# EAGLE design zdrojV3 (EAGLE 6.1)
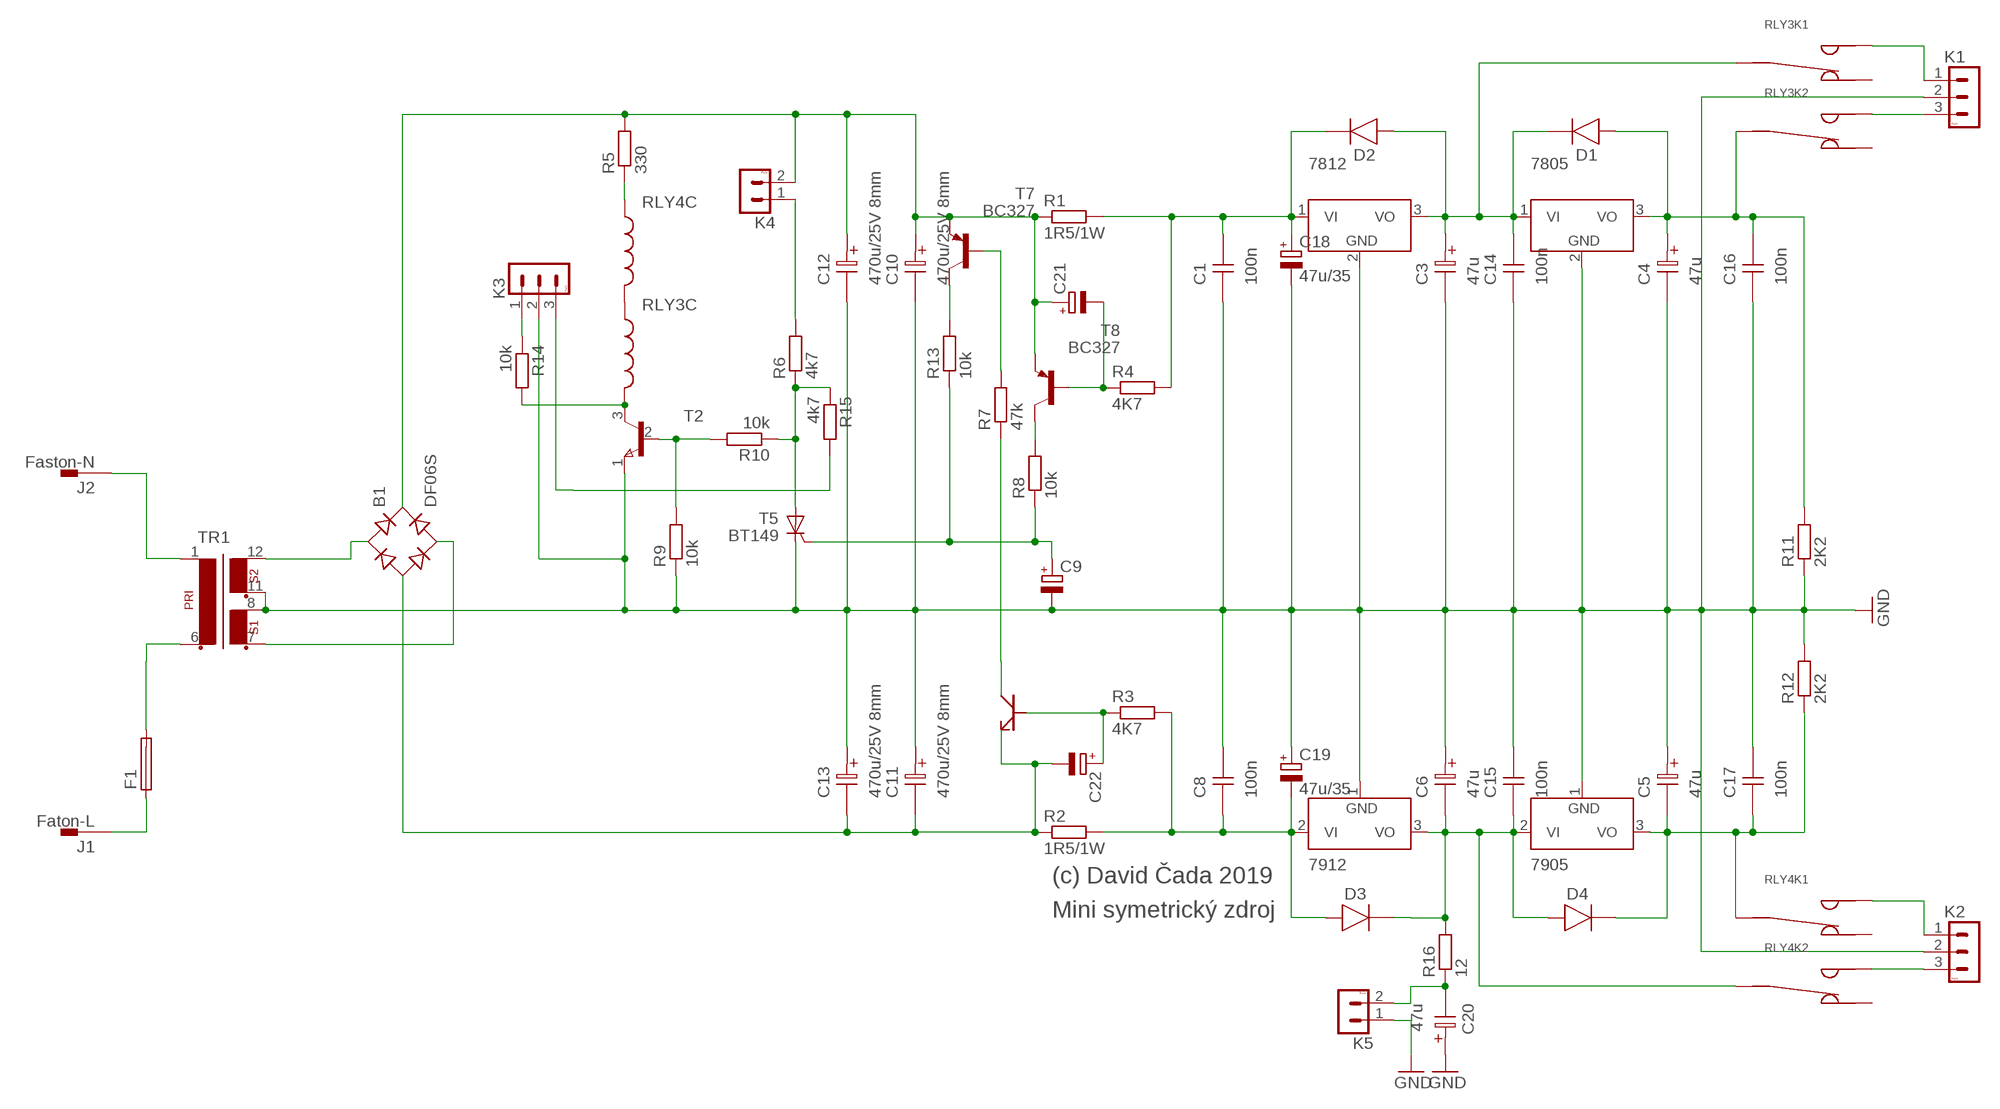
[diagram p0: schematic, sheet 1]

## Parts
7805  7812  [TO-220S]
7812  7805  [TO-220S]
7905  7912  [TO-220S]
7912  7905  [TO-220S]
B1  DF06S  [DFS]
C1  100n  CKS  [CK]
C3  47u  CT12  [CT12]
C4  47u  CT12  [CT12]
C5  47u  CT12  [CT12]
C6  47u  CT12  [CT12]
C8  100n  CKS  [CK]
C9  CPOL-EUE2.5-6  [E2,5-6]
C10  470u/25V 8mm  CT12  [CT12]
C11  470u/25V 8mm  CT12  [CT12]
C12  470u/25V 8mm  CT12  [CT12]
C13  470u/25V 8mm  CT12  [CT12]
C14  100n  CKS  [CK]
C15  100n  CKS  [CK]
C16  100n  CKS  [CK]
C17  100n  CKS  [CK]
C18  47u/35  CPOL-EUE2.5-6  [E2,5-6]
C19  47u/35  CPOL-EUE2.5-6  [E2,5-6]
C20  47u  CT12  [CT12]
C21  CPOL-EUE2.5-6  [E2,5-6]
C22  CPOL-EUE2.5-6  [E2,5-6]
D1  1N4007  [DO41]
D2  1N4007  [DO41]
D3  1N4007  [DO41]
D4  1N4007  [DO41]
F1  19560  [19560]
J1  Faton-L  PIN2F061.100  [F061.100]
J2  Faston-N  PIN2F061.100  [F061.100]
K1  PSH02-03P  [PSH02-03P]
K2  PSH02-03P  [PSH02-03P]
K3  PSH02-03P  [PSH02-03P]
K4  PSH02-02P  [PSH02-02P]
K5  PSH02-02P  [PSH02-02P]
R1  1R5/1W  R-EU_0411/3V  [0411V]
R2  1R5/1W  R-EU_0411/3V  [0411V]
R3  4K7  R-EU_0207/2V  [0207/2V]
R4  4K7  R-EU_0207/2V  [0207/2V]
R5  330  R-EU_0207/2V  [0207/2V]
R6  4k7  R-EU_0207/2V  [0207/2V]
R7  47k  R-EU_0207/2V  [0207/2V]
R8  10k  R-EU_0207/2V  [0207/2V]
R9  10k  R-EU_0207/2V  [0207/2V]
R10  10k  R-EU_0207/2V  [0207/2V]
R11  2K2  R-EU_0207/2V  [0207/2V]
R12  2K2  R-EU_0207/2V  [0207/2V]
R13  10k  R-EU_0207/2V  [0207/2V]
R14  10k  R-EU_0207/2V  [0207/2V]
R15  4k7  R-EU_0207/2V  [0207/2V]
R16  12  R-EU_0207/2V  [0207/2V]
RLY3  RELEG5V2  [RG5V2]
RLY4  RELEG5V2  [RG5V2]
T2  BC337-40  [TO-92C]
T5  BT149  [TO92-4]
T6  MPSA44  [TO92-EBC]
T7  BC327  [TO92]
T8  BC327  [TO92]
TR1  EI48-2  [EI48-2]

## Nets
GND: 7805.2(GND) 7812.2(GND) 7905.1(GND) 7912.1(GND) C1.1 C3.2 C4.2 C5.1 C6.1 C8.2 C9.- C10.2 C11.1 C12.2 C13.1 C14.1 C15.2 C16.1 C17.2 C18.- C19.+ C20.1 K1.2 K2.2 K3.2 K5.1 R9.1 R11.1 R12.2 T2.1(E) T5.C TR1.8 TR1.11
LEDGREEN+: K3.3 R15.2
N$1: R7.2 T7.2(B)
N$2: 7805.1(VI) 7812.3(VO) C3.1 C14.2 D1.K D2.A RLY3.3
N$3: 7905.2(VI) 7912.3(VO) C6.2 C15.1 D3.K D4.A R16.2 RLY4.6
N$4: 7912.2(VI) C8.1 C19.- D3.A R2.2 R3.2
N$5: 7812.1(VI) C1.2 C18.+ D2.K R1.2 R4.2
N$6: K1.1 RLY3.5
N$7: 7905.3(VO) C5.2 C17.1 D4.K R12.1 RLY4.3
N$8: R13.2 T7.3(C)
N$9: R9.2 R10.2 T2.2(B)
N$10: C22.+ R3.1 T6.B
N$11: C21.- R4.1 T8.2(B)
N$12: RLY3.1 RLY4.2
N$13: R5.1 RLY4.1
N$14: C9.+ R8.1 R13.1 T5.G
N$15: R6.1 R10.1 R15.1 T5.A
N$16: R14.2 RLY3.2 T2.3(C)
N$17: K4.1 R6.2
N$18: K3.1 R14.1
N$19: R7.1 T6.E(C)
N$20: R8.2 T8.3(C)
N$21: F1.2 TR1.6
N$22: B1.+ C10.1 C12.1 C21.+ K4.2 R1.1 R5.2 T7.1(E) T8.1(E)
N$23: B1.AC1 TR1.12
N$24: B1.AC2 TR1.7
N$25: 7805.3(VO) C4.1 C16.2 D1.A R11.2 RLY3.6
N$26: B1.- C11.2 C13.2 C22.- R2.1 T6.C(E)
N$28: K1.3 RLY3.8
N$29: K2.1 RLY4.5
N$30: K2.3 RLY4.8
N$31: C20.2 K5.2 R16.1
N$34: J2.A1 J2.A2 TR1.1
POJISTKA: F1.1 J1.A1 J1.A2
Unconnected: RLY3.4 RLY3.7 RLY4.4 RLY4.7

## Notes on the sheet
- (c) David Čada 2019
- Mini symetrický zdroj

## Library data of the parts
7805 = #_GM99:7812
7812 = #_GM99:7805
7905 = #_GM99:7912
7912 = #_GM99:7905
B1 = rectifier:DF*S: Surface Mount Glass Passivated Bridge Rectifiers Source: Source: Comchip Bridge Rectifiers DF005S-G thru DF10S-G.pdf
C1 C8 C14-C17 = #_GM99:CKS
C3-C6 C10-C13 C20 = #_GM99:CT12
C9 C18 C19 C21 C22 = rcl:CPOL-EU: POLARIZED CAPACITOR, European symbol
D1-D4 = #_GM99:1N4007
F1 = fuse:19560: FUSE HOLDER TR5, Wickmann; MPN: 56000001009; OC_FARNELL: 1185363; OC_NEWARK: 15P8392
J1 J2 = con-faston:PIN2: Flachstecker Typ Tyco/Electronics/AMP TAB, FASTON Printed Circuit Board Tabs Source: http://www.buerklin.com, http://catalog.tycoelectronics.com; OC_FARNELL: unknown; OC_NEWARK: unknown
K1-K3 = #PaJa_konektory:PSH02-03: Konektory se zamkem - vidlice - 3pin
K4 K5 = #PaJa_konektory:PSH02-02: Konektory se zamkem - vidlice - 2pin
R1-R16 = rcl:R-EU_: RESISTOR, European symbol
RLY3 RLY4 = #_GM99:RELEG5V2
T2 = #_GM99:BC337-40
T5 = triac:BT149: THYRISTOR
T6 = MPSA44_NEW2:MPSA44
T7 T8 = transistor-pnp:BC327: PNP Transistor
TR1 = trafo:EI48-2: TRANSFORMER 1 primary winding, 2 secondary windings ERA

## Board
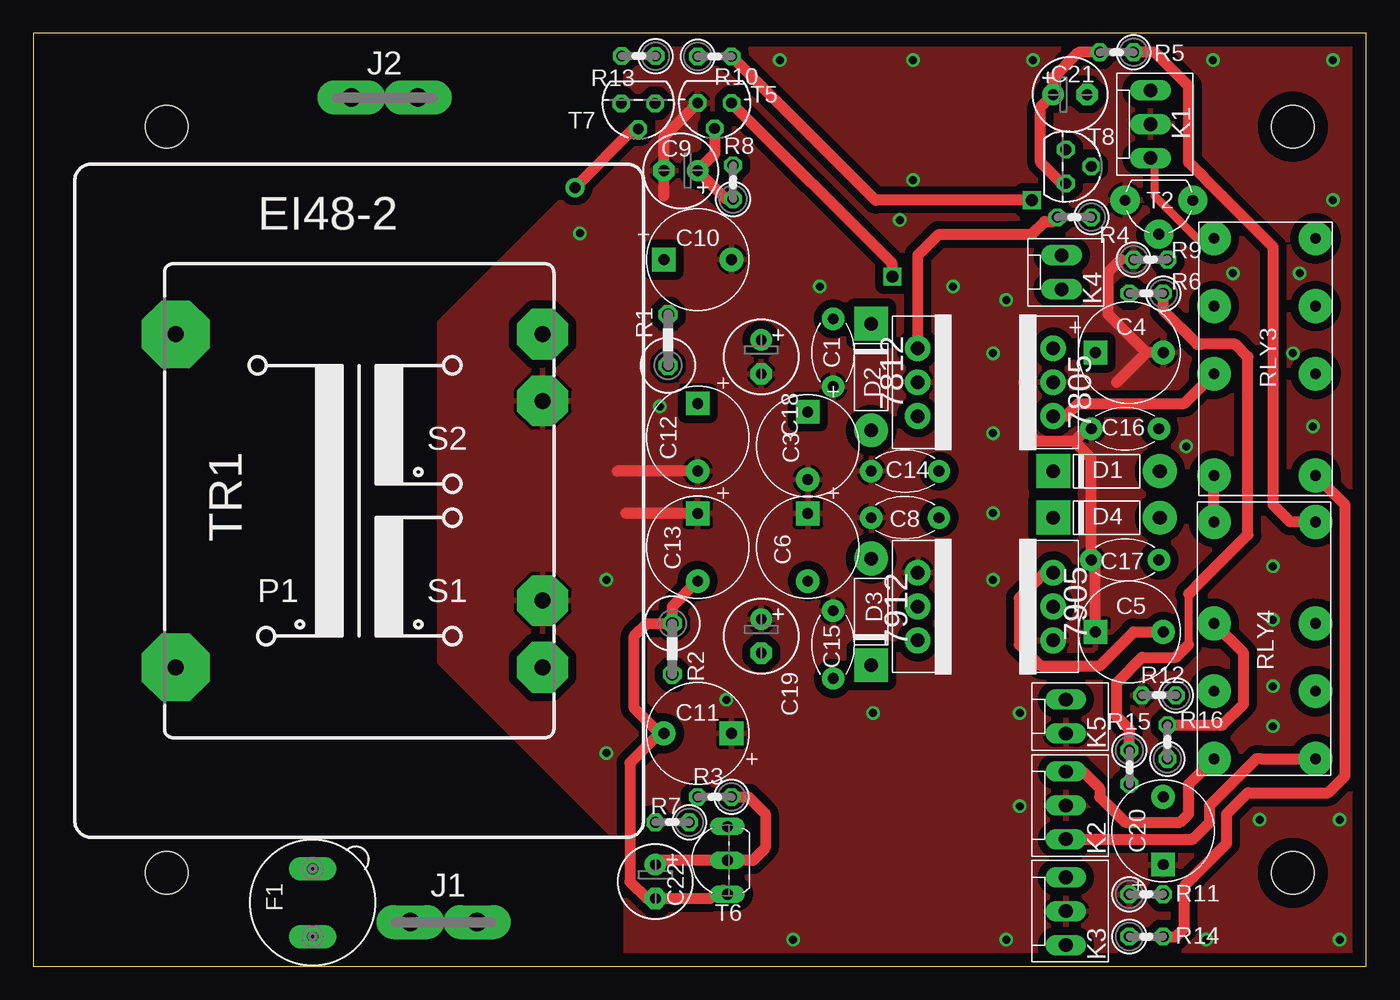
[diagram p1: board, top side]
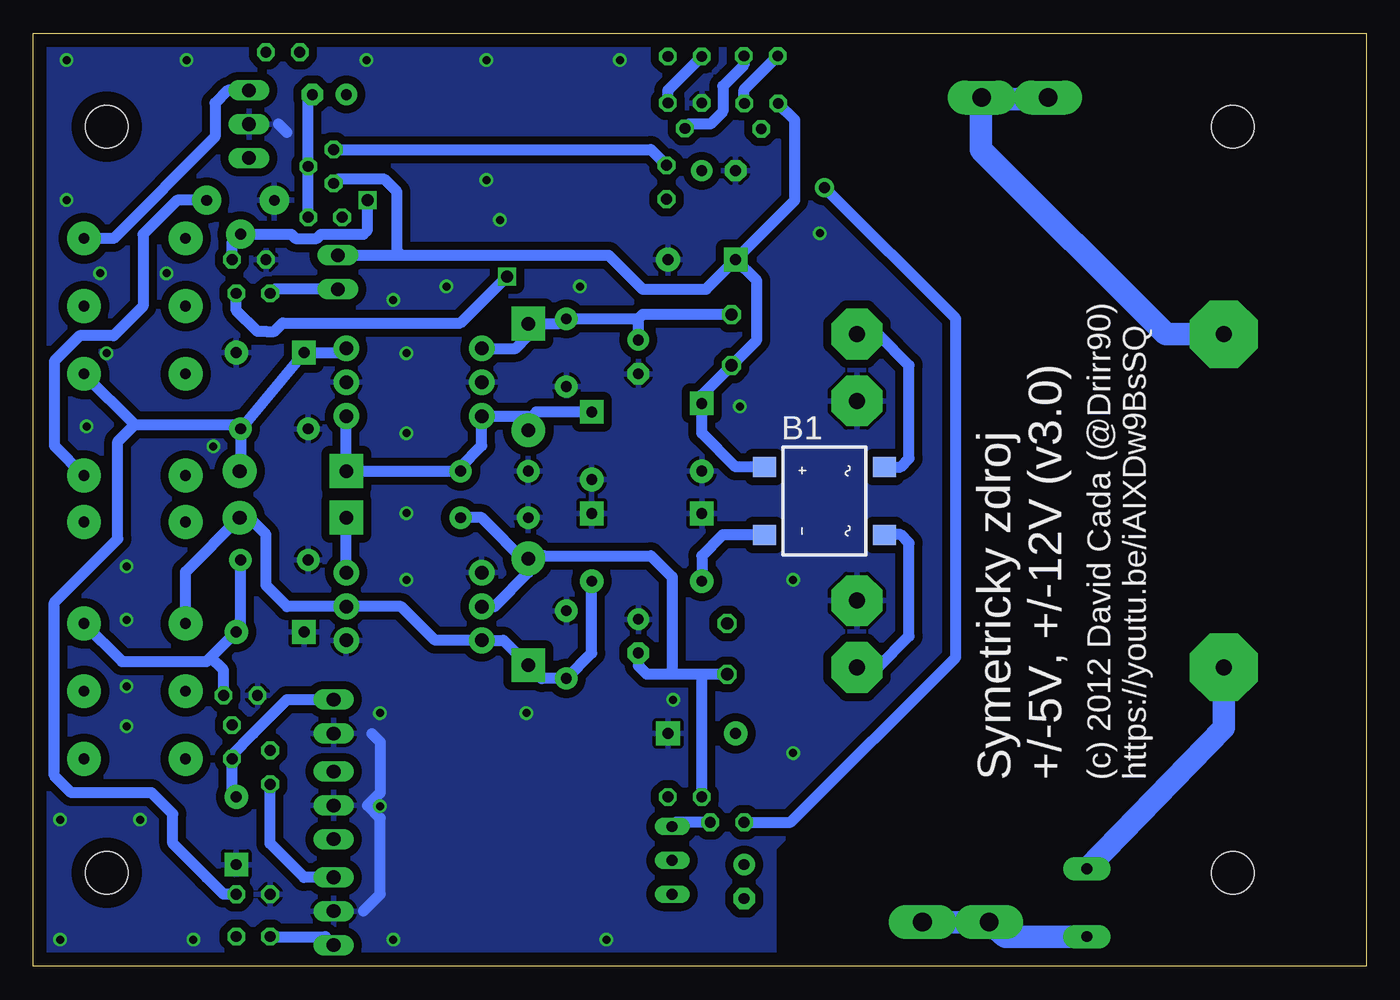
[diagram p2: board, bottom side, seen from below]

Size 100 x 70 mm. Coordinates in mm from the lower left corner, seen from the top.
Outline: 0,0 100,0 100,70 0,70 0,0
Copper layers (1*16): Top 0.035mm / dielectric 1.5mm / Bottom 0.035mm
Design rules "default": minimum track width 10mil, minimum drill 24mil, track to track 8mil, track to pad 8mil, pad to pad 8mil, via to via 8mil, smd to smd 8mil, copper to edge 40mil, drill to drill 8mil, minimum pad ring 10mil, minimum via ring 8mil, stop-mask expansion 4mil, vias tented up to drill 0mil, thermal gap 10mil
Holes 3.2 mm at 10,63 10,7 94.5,63 94.5,7

### Footprints (pad centres in the part's own frame; a part is rotated, then mirrored left to right if it is on the bottom)
TO-220S = drill 1.016 pad 1.93: 1 0,0; 2 2.54,0; 3 5.08,0
DFS = smd 1.5 x 1.7: + -2.55,-4.5; - 2.55,-4.5; AC1 -2.55,4.5; AC2 2.55,4.5
CK = drill 0.813 pad 1.676: 1 0,0; 2 5.08,0
CT12 = drill 0.813 pad 1.778 square: 1 0,0 | drill 0.813 pad 1.778: 2 5.08,0
E2,5-6 = drill 0.813 pad 1.6: + -1.27,0 | drill 0.813 pad 1.6 octagon: - 1.27,0
DO41 = drill 1.016 pad 2.54: A 8,0 | drill 1.016 pad 2.54 square: K 0,0
19560 = drill 0.813 pad 1.778 long: 1 -2.54,0; 2 2.54,0
F061.100 = drill 1.4 pad 2.54 long: A1 -2.5,0; A2 2.5,0
PSH02-03P = drill 1.016 pad 1.422 long: 1 -2.54,0; 2 0,0; 3 2.54,0
PSH02-02P = drill 1.016 pad 1.422 long: 1 -1.27,0; 2 1.27,0
0411V = drill 0.914 octagon: 1 -2.54,0; 2 1.27,0
0207/2V = drill 0.813 octagon: 1 -1.27,0; 2 1.27,0
RG5V2 = drill 0.813 pad 2.54: 1 0,7.62; 2 0,0; 3 7.62,7.62; 4 12.7,7.62; 5 17.78,7.62; 6 7.62,0; 7 12.7,0; 8 17.78,0
TO-92C = drill 0.813 pad 2.184: 1 0,-1.27; 2 2.54,1.27; 3 0,3.81
TO92-4 = drill 0.813 octagon: A -1.27,0; C 1.27,0; G 0,1.905
TO92-EBC = drill 0.813 long: B 0,-1.27; C -2.54,-1.27; E 2.54,-1.27
TO92 = drill 0.813 octagon: 1 1.27,0; 2 0,1.905; 3 -1.27,0
EI48-2 = drill 1.194 pad 5.08 octagon: 1 -13.767,12.497; 6 -13.767,-12.497 | drill 1.194 pad 3.81 octagon: 7 13.767,-12.497; 8 13.767,-7.493; 11 13.767,7.493; 12 13.767,12.497

### Placement (x,y rotation side)
7805  76.52,41.27 90 top
7812  66.36,46.35 270 top
7905  76.52,24.45 90 top
7912  66.36,29.53 270 top
B1  40.64,34.92 270 bottom
C1  60.01,43.5 90 top
C3  58.1,41.59 270 top
C4  79.69,46.04 0 top
C5  79.69,25.08 0 top
C6  58.1,33.97 270 top
C8  67.94,33.66 180 top
C9  48.58,59.69 180 top
C10  47.31,53.02 0 top
C11  52.39,17.46 180 top
C12  49.85,42.23 270 top
C13  49.85,33.97 270 top
C14  62.87,37.15 0 top
C15  60.01,21.59 90 top
C16  79.38,40.32 0 top
C17  84.45,30.48 180 top
C18  54.61,45.72 270 top
C19  54.61,24.77 270 top
C20  84.77,7.62 90 top
C21  77.79,65.41 0 top
C22  46.67,6.35 270 top
D1  76.52,37.15 0 top
D2  62.87,48.21 270 top
D3  62.87,22.59 90 top
D4  76.52,33.66 0 top
F1  20.95,4.76 90 top
J1  30.8,3.3 0 top
J2  26.35,65.18 180 top
K1  83.82,63.18 90 top
K2  77.47,12.06 90 top
K3  77.47,4.13 90 top
K4  77.15,52.07 90 top
K5  77.47,18.73 90 top
R1  47.62,47.62 90 top
R2  47.94,23.18 270 top
R3  51.12,12.7 180 top
R4  78.11,56.2 180 top
R5  81.28,68.58 180 top
R6  83.5,50.48 180 top
R7  47.94,10.79 180 top
R8  52.5,58.83 90 top
R9  83.82,53.02 0 top
R10  51.12,68.26 0 top
R11  83.5,5.4 0 top
R12  84.45,20.32 180 top
R13  45.42,68.3 180 top
R14  83.5,2.22 0 top
R15  82.23,14.92 270 top
R16  85.09,16.83 90 top
RLY3  96.2,36.83 90 top
RLY4  88.58,33.34 270 top
T2  83.19,57.47 270 top
T5  51.12,64.77 180 top
T6  50.8,7.94 90 top
T7  45.38,64.73 180 top
T8  77.47,60.01 270 top
TR1  24.45,34.92 0 top

### Tracks (layer width: path | path; a pad name or v marks a point on that pad's centre or on a via)
GND  (via drill 0.6)
  Top 0.813: C12.2 43.8,37.15 | C13.1 44.44,33.97 | 47.31,57.78 C9.- 47.31,62.23 T5.C | C16.1 79.06,40.32 78.11,39.37 | 78.11,39.37 75.25,39.37 74.61,40.01 74.61,43.5 74.3,43.81 | C4.2 83.5,46.04 | 83.5,46.04 81.28,43.81 | 83.5,46.04 80.64,48.9 80.64,52.07 81.6,53.02 | C5.1 79.69,30.16 C17.2 79.38,38.1 78.11,39.37
  Bottom 0.406: C20.1 84.45,7.62
  Bottom 0.813: 80.96,62.55 81.6,63.18 | 75.25,4.13 73.98,5.4 73.98,11.11 74.93,12.06 73.98,13.02 73.98,16.83 74.61,17.46
  other vias: 65,56 66,59 56,68 66,68 75,68 69,51 59,51 73,50 57,2 73,2 98,2 88,2 92,11 98,11 93,18 93,21 93,30 93,26 86.5,39 90,52 74,12 74,19 63,19 52,20 72,29 72,34 72,40 72,46 41,55 47,42 43,16 43,29 94.5,46 96,40.5 95,52 88.5,68 97.5,68 97.5,57.5
  pour Top (isolate 0.61): 30.48,22.86 43.18,10.16 44.45,8.89 44.45,0 100.33,0 100.33,69.85 44.45,69.85 44.45,62.23 30.48,48.26
  pour Bottom (isolate 0.61): 30.48,22.86 44.45,8.89 44.45,0 100.33,0 100.33,69.85 44.45,69.85 44.45,62.23 30.48,48.26
LEDGREEN+
  Bottom 0.813: K3.3 79.69,6.67 82.23,9.21 R15.2
N$1  (via drill 0.8 pad 1.42)
  Top 0.406: 45.09,62.87 45.38,62.87 T7.2
  Top 0.813: v40.64,58.42 45.09,62.87
  Bottom 0.813: R7.2 43.18,10.79 30.8,23.18 30.8,48.58 v40.64,58.42
N$2
  Top 0.813: 7805.1 77.47,41.27 78.42,42.23 86.36,42.23 RLY3.3
  Bottom 0.813: 62.91,40.95 62.93,41.27 7812.3 66.36,39.05 67.94,37.47 C14.2 D1.K 7805.1 | 62.91,40.95 D2.A | C3.1 62.26,41.59 62.91,40.95
N$3
  Top 0.813: R16.2 89.22,18.1 90.81,19.68 90.81,23.5 RLY4.6
  Bottom 0.813: C6.2 58.1,23.5 C15.1 61.87,21.59 D3.K 64.72,24.45 7912.3 69.85,24.45 72.39,26.99 7905.2 80.96,26.99 82.55,28.57 82.55,32.38 83.82,33.66 D4.A 88.58,29.59 RLY4.6
N$4
  Bottom 0.813: R2.2 50.16,21.91 | 50.16,21.91 52.07,21.91 | 52.07,21.91 53.98,21.91 54.61,22.54 C19.- | R3.2 49.85,21.59 50.16,21.91 | D3.A 61.66,30.8 53.66,30.8 52.07,29.21 52.07,21.91 | D3.A 62.87,29.53 65.41,26.99 7912.2 | D3.A 62.87,30.16 66.36,33.66 C8.1
N$5
  Top 0.813: 7812.1 66.36,53.34 67.94,54.93 74.93,54.93 75.88,55.88 76.52,55.88 R4.2
  Bottom 0.813: R1.2 54.29,48.9 54.61,48.58 | 7812.1 63.82,46.35 62.87,47.31 D2.K 60.64,48.21 C1.2 54.61,48.58 | C18.+ 54.61,48.58
N$6
  Top 0.61: RLY3.5 87.31,54.61 84.14,57.78 84.14,60.33 K1.1
N$7
  Top 0.813: 7905.3 75.88,29.53 73.98,27.62 73.98,24.13 75.56,22.54 80.01,22.54 82.55,25.08 C5.2
  Bottom 0.813: 7905.3 D4.K | D4.K 76.2,33.34 76.2,33.66 D4.K | D4.K 76.83,33.34 76.83,33.66 | RLY4.3 93.34,22.86 87,22.86 86.68,23.18 | C17.1 84.45,25.4 C5.2 86.68,23.18 | R12.1 85.72,22.23 86.68,23.18
N$8
  Bottom 0.813: T7.3 46.66,64.75 46.67,64.77 46.67,65.78 R13.2
N$9  (via drill 0.9)
  Top 0.813: v74.93,57.47 63.18,57.47 R10.2
  Bottom 0.813: R9.2 85.09,54.29 T2.2 80.64,54.93 80.33,54.61 78.74,54.61 78.42,54.93 75.25,54.93 74.93,55.24 v74.93,57.47
N$10
  Top 0.813: R3.1 53.66,12.7 54.93,11.43 54.93,8.89 53.98,7.94 T6.B 46.99,7.94 C22.+
N$11
  Bottom 0.813: R4.1 T8.2 79.38,65.09 C21.-
N$12
  Top 0.813: RLY4.2 RLY3.1
N$13
  Top 0.813: RLY4.1 94.3,33.34 93.03,34.61 93.03,53.98 89.22,57.78 86.68,60.33 86.68,66.04 84.14,68.58 R5.1
N$14
  Top 0.813: T5.G 51.12,60.96 C9.+ 51.98,57.56 R8.1
  Bottom 0.813: R13.1 46.69,67.61 48.26,66.04 48.26,64.14 49.21,63.18 50.8,63.18 T5.G
N$15  (via drill 0.9)
  Top 0.61: 86.68,24.13 86.68,27.94
  Top 0.813: R15.1 82.23,17.78 81.28,18.73 81.28,21.27 83.19,23.18 85.72,23.18 86.68,24.13 | 86.68,27.94 87.63,28.89 91.12,32.38 91.12,45.72 90.17,46.67 87.63,46.67 87.31,46.67 84.77,49.21 R6.1 | v64.45,51.75 64.45,52.7 T5.A
  Bottom 0.813: T5.A 52.39,65.72 R10.1 | v64.45,51.75 67.94,48.26 81.28,48.26 81.92,47.62 82.55,47.62 83.19,47.62 84.77,49.21 R6.1
N$16
  Top 0.813: R14.2 85.72,2.22 86.36,2.86 86.36,6.03 87,6.67 89.53,9.21 89.53,11.43 91.12,13.02 97.16,13.02 98.42,14.29 98.42,34.61 RLY3.2
  Bottom 0.813: T2.3 89.22,57.47 91.76,54.93 91.76,49.53 93.98,47.31 96.52,47.31 98.42,45.4 98.42,39.05 RLY3.2
N$17
  Bottom 0.813: K4.1 81.92,50.8 R6.2
N$18
  Bottom 0.813: R14.1 78.11,2.22 K3.1
N$19
  Bottom 0.813: R7.1 51.75,10.79 T6.E
N$20
  Top 0.813: R8.2 52.48,60.1 52.39,60.01
  Bottom 0.813: T8.3 53.67,61.28 R8.2
N$21
  Bottom 1.676: TR1.6 10.68,17.89 F1.2
N$22
  Top 0.813: T8.1 77.15,58.74 75.56,60.33 75.56,64.45 C21.+ 76.52,66.67 78.42,68.58 R5.2
  Bottom 0.813: 72.39,53.34 K4.2 73.03,53.34 72.71,53.66 | 72.39,53.34 56.83,53.34 54.29,50.8 49.53,50.8 C10.1 | C10.1 42.86,57.47 42.86,63.48 T7.1 | 72.71,53.66 72.39,53.34 | 72.71,53.66 72.71,58.1 73.66,59.05 77.15,59.05 T8.1 | C10.1 45.72,51.44 45.72,46.99 R1.1 49.85,42.86 C12.1 49.85,40.32 49.85,40.01 47.32,37.48 B1.+
N$23
  Bottom 0.813: TR1.12 36.63,47.42 34.29,45.09 34.29,38.1 34.91,37.48 B1.AC1
N$24
  Bottom 0.813: TR1.7 36.63,22.43 34.29,24.77 34.29,31.75 34.92,32.38 B1.AC2
N$25
  Bottom 0.813: C16.2 C4.1 76.83,46.04 7805.3 | RLY3.6 92.39,40.64 | 92.39,40.64 88.01,40.64 84.77,40.64 C16.2 | C16.2 84.45,37.21 D1.A | R11.2 85.72,5.4 87,6.67 88.9,8.57 89.53,9.21 89.53,11.43 91.12,13.02 97.16,13.02 98.42,14.29 98.42,27.3 93.66,32.07 93.66,39.37 92.39,40.64
N$26
  Top 0.813: 46.99,17.46 44.77,15.24 44.77,6.35 46.04,5.08 C22.- | 51.75,5.71 T6.C 51.12,5.4 50.8,5.08 C22.- | C11.2 46.99,17.46 | 46.99,17.46 45.09,19.37 45.09,24.77 46.04,25.72 R2.1 47.94,26.99 C13.2 | C22.- 46.35,5.08
  Bottom 0.813: C13.2 49.85,30.8 48.26,32.38 B1.-
N$28
  Bottom 0.813: K1.3 85.41,65.72 86.36,64.77 86.36,62.23 93.98,54.61 RLY3.8
N$29
  Top 0.813: RLY4.5 92.08,15.56 91.76,15.56 89.22,13.02 88.27,12.06 88.27,10.79 87,9.53 80.33,9.53 80.01,9.53 79.69,9.53 78.74,9.53 K2.1
N$30
  Top 0.813: K2.3 78.74,14.61 80.01,13.34 80.01,12.7 81.92,10.79 86.04,10.79 86.68,11.43 86.68,13.65 RLY4.8
N$31
  Bottom 0.813: 77.79,19.68 K5.2 80.33,20 80.96,20 81.28,19.68 83.5,17.46 85.09,15.88 R16.1 85.09,12.7 C20.2
N$34
  Bottom 0.813: 28.89,65.07 J2.A1 | 23.81,65.07 J2.A2
  Bottom 1.676: TR1.1 15.04,47.42 28.89,61.28 28.89,65.07 23.81,65.07
POJISTKA
  Bottom 1.676: J1.A2 J1.A1 27.07,2.22 F1.1

### Text on the board
bPlace: (c) 2012 David Cada (@Drirr90) / https://youtu.be/iAIXDw9BsSQ | Symetricky zdroj / +/-5V, +/-12V (v3.0)
bOrigins: PSU V3.0